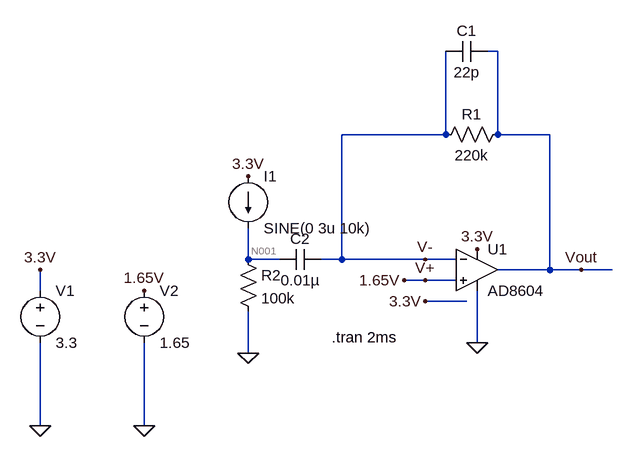
[diagram p0: schematic ir_sensor.asc]
ir_sensor.asc, the LTspice schematic file:
Version 4
SHEET 1 880 680
WIRE 272 -160 256 -160
WIRE 192 -32 192 -160
WIRE 192 -32 32 -32
WIRE 272 -32 272 -160
WIRE 352 -32 272 -32
WIRE -112 160 -112 112
WIRE -64 160 -112 160
WIRE 32 160 32 -32
WIRE 32 160 0 160
WIRE 160 160 32 160
WIRE 208 160 160 160
WIRE 352 176 352 -32
WIRE 352 176 272 176
WIRE 400 176 352 176
WIRE 448 176 400 176
WIRE 160 192 128 192
WIRE 208 192 160 192
WIRE -432 208 -432 176
WIRE 224 224 160 224
WIRE 240 288 240 208
WIRE -112 304 -112 240
WIRE -432 416 -432 288
WIRE -272 416 -272 288
FLAG 240 288 0
FLAG -432 176 3.3V
FLAG 240 144 3.3V
FLAG -432 416 0
FLAG -272 416 0
FLAG -272 208 1.65V
FLAG 128 192 1.65V
FLAG -112 304 0
FLAG 160 224 3.3V
FLAG 400 176 Vout
FLAG -112 32 3.3V
FLAG 160 160 V-
FLAG 160 192 V+
SYMBOL voltage -432 192 R0
WINDOW 123 0 0 Left 0
WINDOW 39 0 0 Left 0
SYMATTR InstName V1
SYMATTR Value 3.3
SYMBOL current -112 32 R0
WINDOW 123 0 0 Left 0
WINDOW 39 0 0 Left 0
SYMATTR InstName I1
SYMATTR Value SINE(0 3u 10k)
SYMBOL voltage -272 192 R0
WINDOW 123 0 0 Left 0
WINDOW 39 0 0 Left 0
SYMATTR InstName V2
SYMATTR Value 1.65
SYMBOL res 288 -48 R90
WINDOW 0 0 56 VBottom 2
WINDOW 3 32 56 VTop 2
SYMATTR InstName R1
SYMATTR Value 220k
SYMBOL cap 256 -176 R90
WINDOW 0 0 32 VBottom 2
WINDOW 3 32 32 VTop 2
SYMATTR InstName C1
SYMATTR Value 22p
SYMBOL cap 0 144 R90
WINDOW 0 0 32 VBottom 2
WINDOW 3 32 32 VTop 2
SYMATTR InstName C2
SYMATTR Value 0.01µ
SYMBOL res -128 144 R0
SYMATTR InstName R2
SYMATTR Value 100k
SYMBOL OpAmps\\AD8604 240 112 R0
SYMATTR InstName U1
TEXT 16 280 Left 2 !.tran 2ms

The netlist it stands for:
* ir_sensor.asc
V1 3.3V 0 3.3
I1 3.3V N001 SINE(0 3u 10k)
V2 V+ 0 1.65
R1 Vout V- 220k
C1 Vout V- 22p
C2 V- N001 0.01µ
R2 N001 0 100k
XU1 V+ V- 3.3V 0 Vout AD8604  ; pins In+ In- V+ V- OUT
.tran 2ms
.backanno
.end

* Results of the author's LTspice run, read from the files saved beside the schematic
* Operating Point, zero values left out:
*   V(3.3v) = 3.3 V
*   V(v+) = 1.65 V
*   V(vout) = 1.65 V
*   V(v-) = 1.65 V
*   I(R1) = -2.5 pA
*   I(V2) = -2.5 pA
*   I(V1) = -663.3 µA
*   Ix(u1:1) = 2.5 pA
*   Ix(u1:2) = -2.5 pA
*   Ix(u1:99) = 663.3 µA
*   Ix(u1:50) = -663.3 µA
*   Ix(u1:45) = 2.5 pA
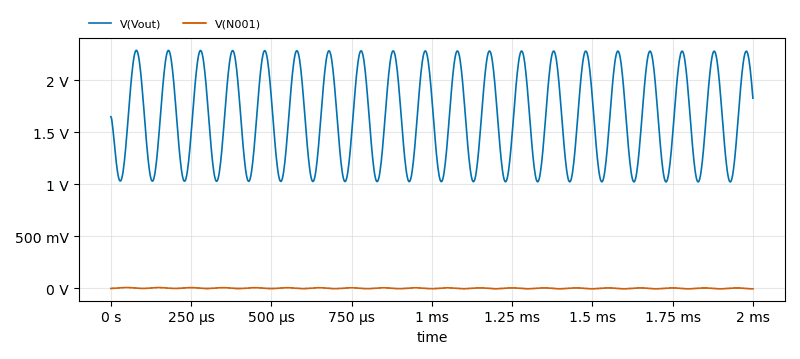
[diagram p1: Transient Analysis of ir_sensor.asc, plotted from the saved traces]
* Transient Analysis, 1 run:
*   V(Vout): min 1.023 V, max 2.288 V, average 1.654 V, rms 1.713 V, last 1.828 V
*   V(N001): min -3.484 mV, max 8.653 mV, average 2.06 mV, rms 3.751 mV, last -3.482 mV